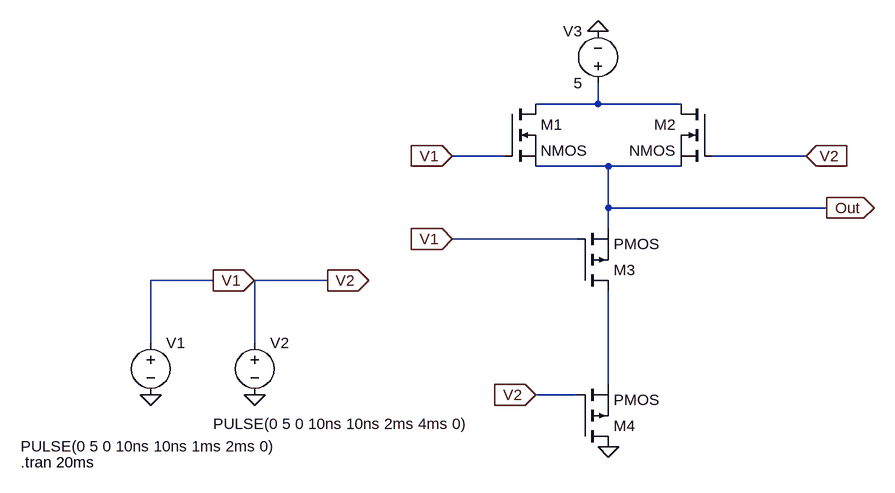
[diagram p0: schematic OR.asc]
OR.asc, the LTspice schematic file:
Version 4
SHEET 1 880 696
WIRE 176 128 176 96
WIRE 176 128 80 128
WIRE 304 128 176 128
WIRE 32 208 -48 208
WIRE 496 208 352 208
WIRE 192 224 80 224
WIRE 304 224 192 224
WIRE 192 288 192 224
WIRE 528 288 192 288
WIRE 192 320 192 288
WIRE 144 336 -48 336
WIRE -416 400 -512 400
WIRE -240 400 -352 400
WIRE -512 496 -512 400
WIRE -352 496 -352 400
WIRE 192 560 192 416
WIRE 144 576 80 576
FLAG 176 16 0
FLAG 192 656 0
FLAG 496 208 V2
IOPIN 496 208 In
FLAG -48 208 V1
IOPIN -48 208 In
FLAG 80 576 V2
IOPIN 80 576 In
FLAG -48 336 V1
IOPIN -48 336 In
FLAG -512 576 0
FLAG -352 576 0
FLAG -240 400 V2
IOPIN -240 400 Out
FLAG -416 400 V1
IOPIN -416 400 Out
FLAG 528 288 Out
IOPIN 528 288 Out
SYMBOL voltage 176 112 R180
WINDOW 0 24 96 Left 2
WINDOW 3 24 16 Left 2
WINDOW 123 0 0 Left 0
WINDOW 39 0 0 Left 0
SYMATTR InstName V3
SYMATTR Value 5
SYMBOL nmos 32 128 R0
SYMATTR InstName M1
SYMBOL nmos 352 128 M0
SYMATTR InstName M2
SYMBOL pmos 144 416 M180
SYMATTR InstName M3
SYMBOL pmos 144 656 M180
SYMATTR InstName M4
SYMBOL voltage -512 480 R0
WINDOW 3 -200 175 Left 2
WINDOW 123 0 0 Left 0
WINDOW 39 0 0 Left 0
SYMATTR Value PULSE(0 5 0 10ns 10ns 1ms 2ms 0)
SYMATTR InstName V1
SYMBOL voltage -352 480 R0
WINDOW 3 -64 141 Left 2
WINDOW 123 0 0 Left 0
WINDOW 39 0 0 Left 0
SYMATTR Value PULSE(0 5 0 10ns 10ns 2ms 4ms 0)
SYMATTR InstName V2
TEXT -712 680 Left 2 !.tran 20ms

The netlist it stands for:
* OR.asc
V3 N001 0 5
M1 N001 V1 Out Out NMOS
M2 N001 V2 Out Out NMOS
M3 N002 V1 Out Out PMOS
M4 0 V2 N002 N002 PMOS
V1 V1 0 PULSE(0 5 0 10ns 10ns 1ms 2ms 0)
V2 V2 0 PULSE(0 5 0 10ns 10ns 2ms 4ms 0)
.model NMOS NMOS
.model PMOS PMOS
.lib standard.mos
.tran 20ms
.backanno
.end